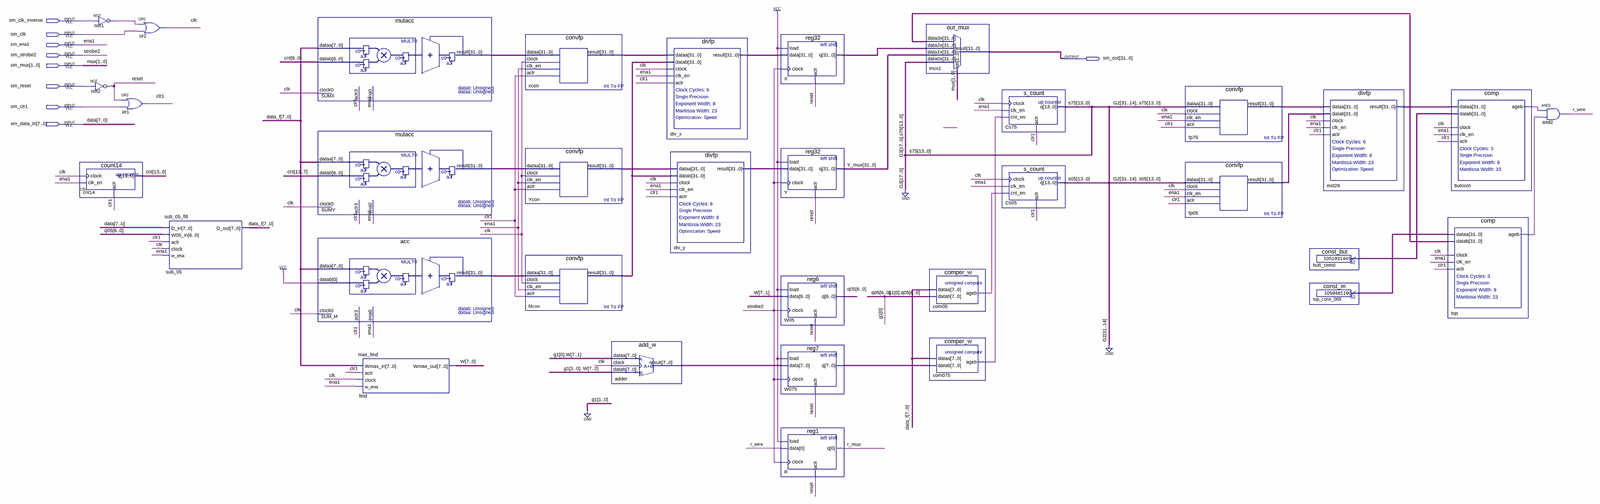
[diagram p0: schematic sheet, whole]
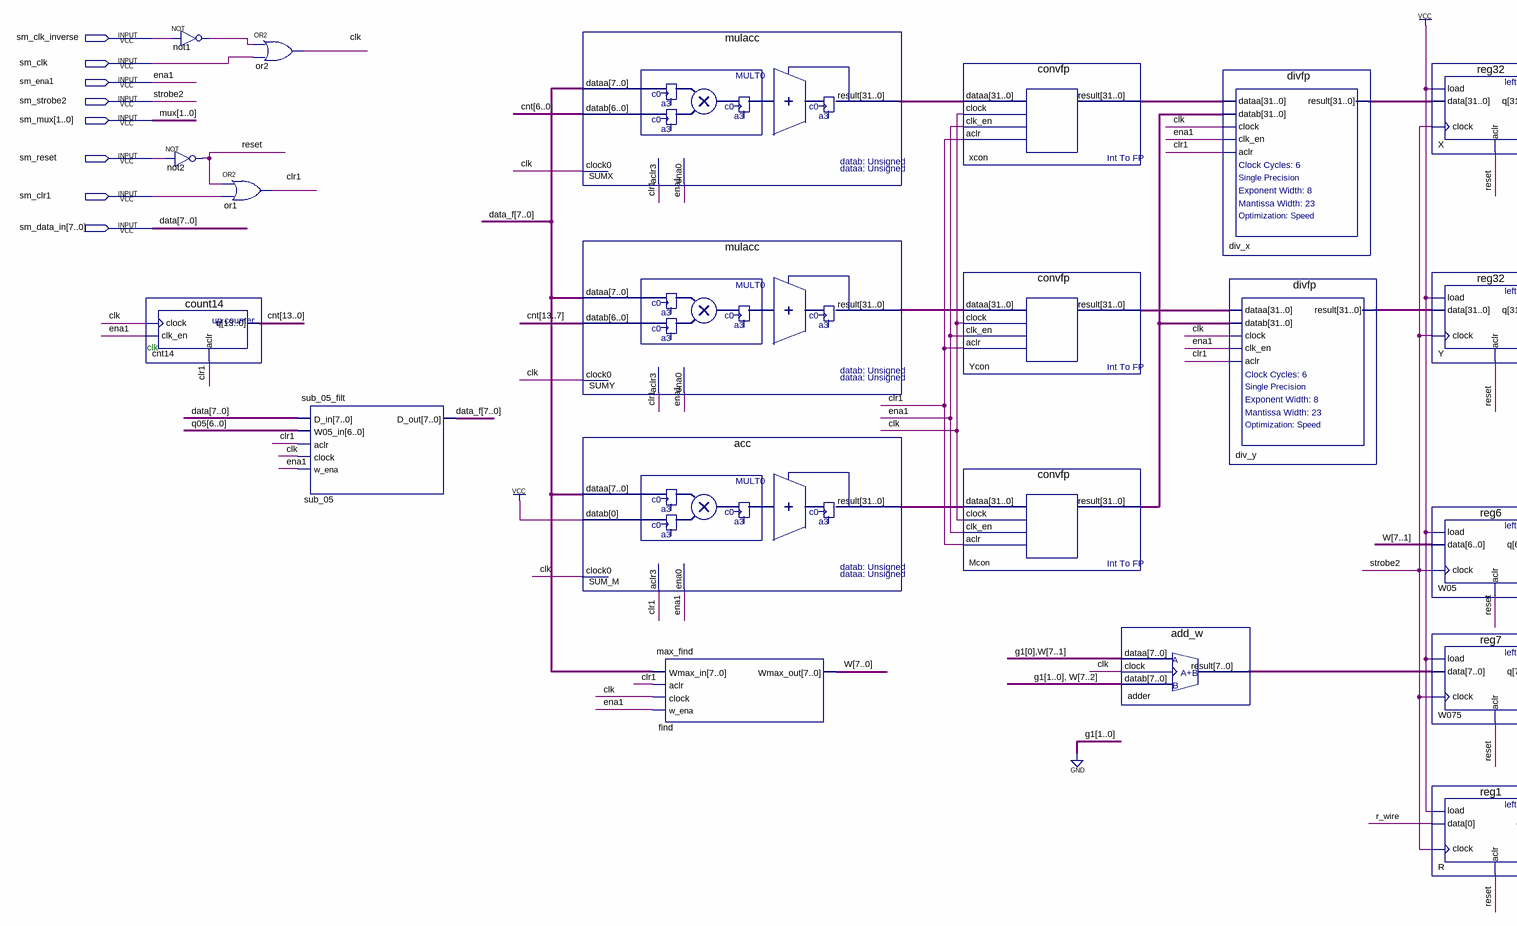
[diagram p1: schematic sheet, left part]
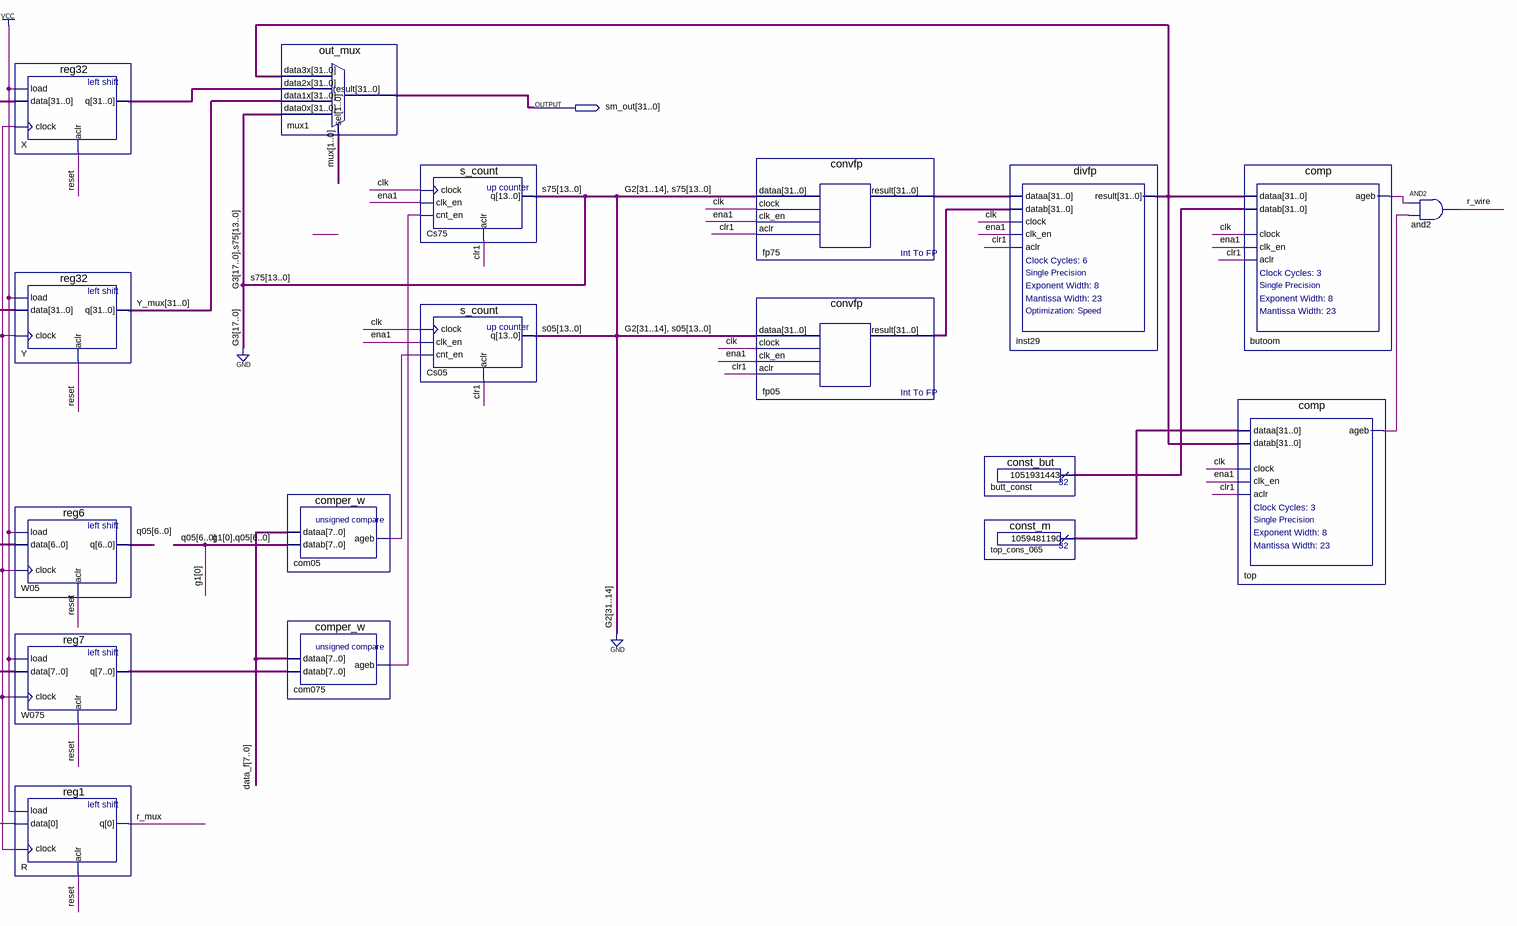
[diagram p2: schematic sheet, right part]
// Quartus schematic SM.bdf as structural Verilog: 34 symbols, 9 pins
module SM (
  input  sm_clk_inverse,
  input  sm_clk,
  input  sm_ena1,
  input  sm_strobe2,
  input  [1:0] sm_mux,
  input  sm_reset,
  input  sm_clr1,
  input  [7:0] sm_data_in,
  output [31:0] sm_out
);

  wire butoom_ageb, clk, clr1, com05_ageb, com075_ageb, not1_out, r_mux, r_wire, reset, top_ageb;
  wire [6:0] q05;
  wire [7:0] adder_result, data_f, W, W075_q;
  wire [13:0] cnt, s05, s75;
  wire [31:0] butt_const_result, div_x_result, div_y_result, fp05_result, fp75_result, inst29_result,
       Mcon_result, SUM_M_result, SUMX_result, SUMY_result, top_cons_065_result, X_q, xcon_result, Y_mux,
       Ycon_result;

  not not1 (not1_out, sm_clk_inverse);
  not not2 (reset, sm_reset);
  count14 cnt14 (.clock(clk), .clk_en(sm_ena1), .aclr(clr1), .q(cnt));
  or or1 (clr1, reset, sm_clr1);
  or or2 (clk, not1_out, sm_clk);
  sub_05_filt sub_05 (.D_in(sm_data_in), .W05_in(q05), .aclr(clr1), .clock(clk), .w_ena(sm_ena1), .D_out(data_f));
  mulacc SUMX (.dataa(data_f), .datab(cnt[6:0]), .clock0(clk), .aclr3(clr1), .ena0(sm_ena1), .result(SUMX_result));
  mulacc SUMY (.dataa(data_f), .datab(cnt[13:7]), .clock0(clk), .aclr3(clr1), .ena0(sm_ena1), .result(SUMY_result));
  acc SUM_M (.dataa(data_f), .datab(1'b1), .clock0(clk), .aclr3(clr1), .ena0(sm_ena1), .result(SUM_M_result));
  max_find find (.Wmax_in(data_f), .aclr(clr1), .clock(clk), .w_ena(sm_ena1), .Wmax_out(W));
  convfp xcon (.dataa(SUMX_result), .clock(clk), .clk_en(sm_ena1), .aclr(clr1), .result(xcon_result));
  convfp Ycon (.dataa(SUMY_result), .clock(clk), .clk_en(sm_ena1), .aclr(clr1), .result(Ycon_result));
  convfp Mcon (.dataa(SUM_M_result), .clock(clk), .clk_en(sm_ena1), .aclr(clr1), .result(Mcon_result));
  add_w adder (.dataa({1'b0, W[7:1]}), .datab({2'b00, W[7:2]}), .clock(clk), .result(adder_result));
  divfp div_x (
    .dataa(xcon_result), .datab(Mcon_result), .clock(clk), .clk_en(sm_ena1), .aclr(clr1),
    .result(div_x_result));
  divfp div_y (
    .dataa(Ycon_result), .datab(Mcon_result), .clock(clk), .clk_en(sm_ena1), .aclr(clr1),
    .result(div_y_result));
  reg32 X (.load(1'b1), .data(div_x_result), .clock(sm_strobe2), .aclr(reset), .q(X_q));
  reg32 Y (.load(1'b1), .data(div_y_result), .clock(sm_strobe2), .aclr(reset), .q(Y_mux));
  reg6 W05 (.load(1'b1), .data(W[7:1]), .clock(sm_strobe2), .aclr(reset), .q(q05));
  reg7 W075 (.load(1'b1), .data(adder_result), .clock(sm_strobe2), .aclr(reset), .q(W075_q));
  reg1 R (.load(1'b1), .data(r_wire), .clock(sm_strobe2), .aclr(reset), .q(r_mux));
  out_mux mux1 (
    .data3x(inst29_result), .data2x(X_q), .data1x(Y_mux), .data0x({{18{1'b0}}, s75}), .sel(sm_mux),
    .result(sm_out));
  comper_w com05 (.dataa(data_f), .datab({1'b0, q05}), .ageb(com05_ageb));
  comper_w com075 (.dataa(data_f), .datab(W075_q), .ageb(com075_ageb));
  s_count Cs75 (.clock(clk), .clk_en(sm_ena1), .cnt_en(com075_ageb), .aclr(clr1), .q(s75));
  s_count Cs05 (.clock(clk), .clk_en(sm_ena1), .cnt_en(com05_ageb), .aclr(clr1), .q(s05));
  convfp fp75 (.dataa({{18{1'b0}}, s75}), .clock(clk), .clk_en(sm_ena1), .aclr(clr1), .result(fp75_result));
  convfp fp05 (.dataa({{18{1'b0}}, s05}), .clock(clk), .clk_en(sm_ena1), .aclr(clr1), .result(fp05_result));
  const_but butt_const (.result(butt_const_result));
  const_m top_cons_065 (.result(top_cons_065_result));
  divfp inst29 (
    .dataa(fp75_result), .datab(fp05_result), .clock(clk), .clk_en(sm_ena1), .aclr(clr1),
    .result(inst29_result));
  comp butoom (
    .dataa(inst29_result), .datab(butt_const_result), .clock(clk), .clk_en(sm_ena1), .aclr(clr1),
    .ageb(butoom_ageb));
  comp top (
    .dataa(top_cons_065_result), .datab(inst29_result), .clock(clk), .clk_en(sm_ena1), .aclr(clr1),
    .ageb(top_ageb));
  and and2 (r_wire, butoom_ageb, top_ageb);

  // Other names for the same wires on the sheet: data[7:0] = sm_data_in; ena1 = sm_ena1; mux[1:0] = sm_mux;
  //   strobe2 = sm_strobe2

  // Notes on the sheet:
  //   clk
endmodule
